# EAGLE design Cellphone (EAGLE 6.1)
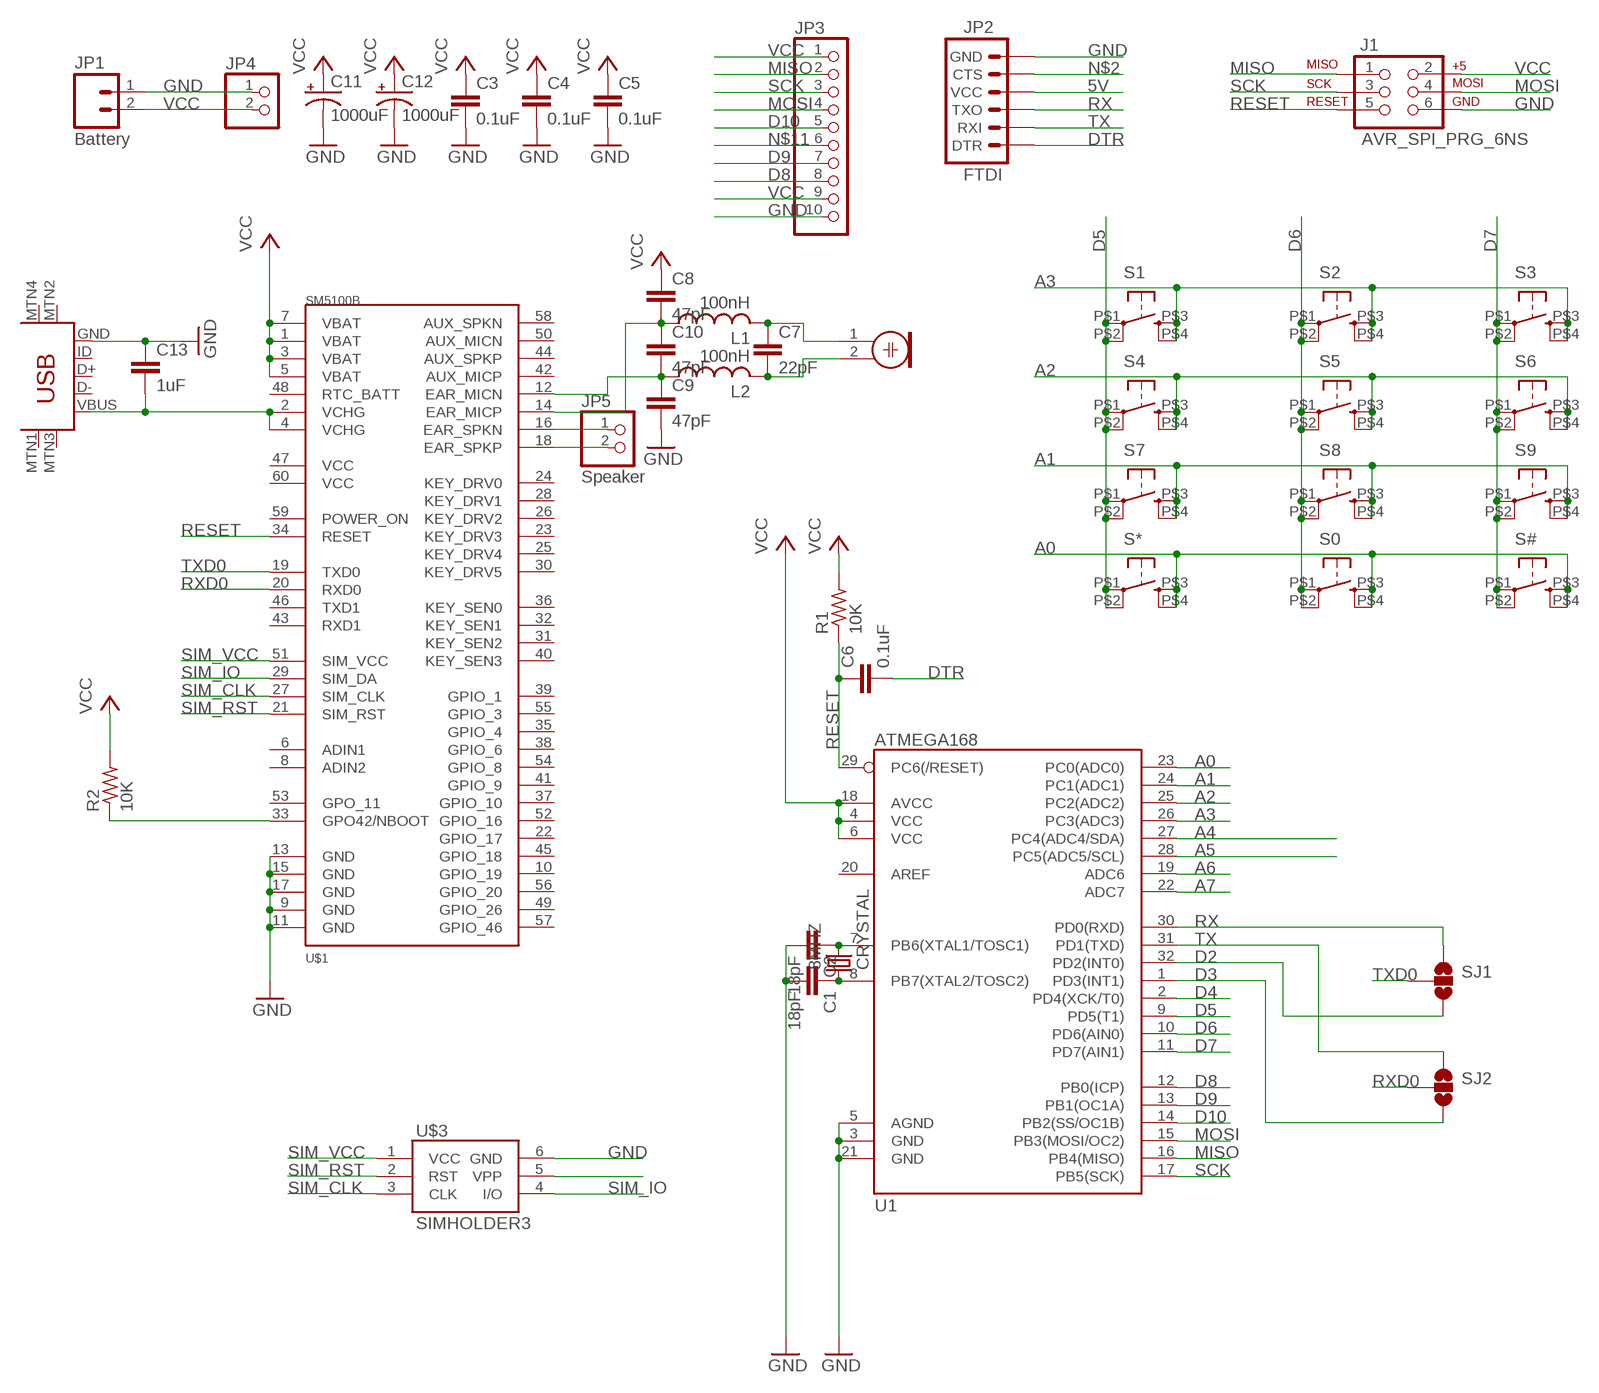
[diagram p0: schematic, sheet 1]

## Parts
8MHZ  CRYSTAL  [2-SMD-5X3MM]
C1  18pF  C-EUC1206  [C1206]
C2  18pF  C-EUC1206  [C1206]
C3  0.1uF  C-EUC1206  [C1206]
C4  0.1uF  C-EUC1206  [C1206]
C5  0.1uF  C-EUC1206  [C1206]
C6  0.1uF  C-EUC1206  [C1206]
C7  22pF  C-EUC1206  [C1206]
C8  47pF  C-EUC1206  [C1206]
C9  47pF  C-EUC1206  [C1206]
C10  47pF  C-EUC1206  [C1206]
C11  1000uF  CPOL-USD/7343-31R  [D/7343-31R]
C12  1000uF  CPOL-USD/7343-31R  [D/7343-31R]
C13  1uF  C-EUC1206  [C1206]
J1  AVR_SPI_PRG_6NS  [2X3-NS]
JP1  Battery  M02-JST-2MM-SMT  [JST-2-SMD]
JP2  FTDI  ARDUINO_SERIAL_PROGRAMPTH  [1X06]
JP3  TFT160X128  [TFT1.8]
JP4  PINHD-1X2  [1X02]
JP5  Speaker  PINHD-1X2  [1X02]
L1  100nH  L-USL2012C  [L2012C]
L2  100nH  L-USL2012C  [L2012C]
M1  ELECTRET_MICROPHON-WM-64PC/64PK  [WM-64PC/64PK]
R1  10K  R-US_R1206  [R1206]
R2  10K  R-US_R1206  [R1206]
S0  SWITCH-JLEAD  [BUTTON_6MM_JLEAD]
S1  SWITCH-JLEAD  [BUTTON_6MM_JLEAD]
S2  SWITCH-JLEAD  [BUTTON_6MM_JLEAD]
S3  SWITCH-JLEAD  [BUTTON_6MM_JLEAD]
S4  SWITCH-JLEAD  [BUTTON_6MM_JLEAD]
S5  SWITCH-JLEAD  [BUTTON_6MM_JLEAD]
S6  SWITCH-JLEAD  [BUTTON_6MM_JLEAD]
S7  SWITCH-JLEAD  [BUTTON_6MM_JLEAD]
S8  SWITCH-JLEAD  [BUTTON_6MM_JLEAD]
S9  SWITCH-JLEAD  [BUTTON_6MM_JLEAD]
S#  SWITCH-JLEAD  [BUTTON_6MM_JLEAD]
S*  SWITCH-JLEAD  [BUTTON_6MM_JLEAD]
SJ1  SOLDERJUMPER_2WAYPASTE1&2  [SJ_3_PASTE1&2]
SJ2  SOLDERJUMPER_2WAYPASTE1&2  [SJ_3_PASTE1&2]
U1  ATMEGA168  [TQFP32-08]
U$1  SM5100B  [SM5100B]
U$2  USB-MINIB-5PIN  [USB-MINIB]
U$3  SIMHOLDER3  [SIMHOLDER3]

## Nets
5V: JP2.4(VCC)
A0: S0.P$3(S) S0.P$4(S1) S#.P$3(S) S#.P$4(S1) S*.P$3(S) S*.P$4(S1) U1.23(PC0(ADC0))
A1: S7.P$3(S) S7.P$4(S1) S8.P$3(S) S8.P$4(S1) S9.P$3(S) S9.P$4(S1) U1.24(PC1(ADC1))
A2: S4.P$3(S) S4.P$4(S1) S5.P$3(S) S5.P$4(S1) S6.P$3(S) S6.P$4(S1) U1.25(PC2(ADC2))
A3: S1.P$3(S) S1.P$4(S1) S2.P$3(S) S2.P$4(S1) S3.P$3(S) S3.P$4(S1) U1.26(PC3(ADC3))
A4: U1.27(PC4(ADC4/SDA))
A5: U1.28(PC5(ADC5/SCL))
A6: U1.19(ADC6)
A7: U1.22(ADC7)
D2: SJ1.3 U1.32(PD2(INT0))
D3: SJ2.3 U1.1(PD3(INT1))
D4: U1.2(PD4(XCK/T0))
D5: S1.P$1(P) S1.P$2(P1) S4.P$1(P) S4.P$2(P1) S7.P$1(P) S7.P$2(P1) S*.P$1(P) S*.P$2(P1) U1.9(PD5(T1))
D6: S0.P$1(P) S0.P$2(P1) S2.P$1(P) S2.P$2(P1) S5.P$1(P) S5.P$2(P1) S8.P$1(P) S8.P$2(P1) U1.10(PD6(AIN0))
D7: S3.P$1(P) S3.P$2(P1) S6.P$1(P) S6.P$2(P1) S9.P$1(P) S9.P$2(P1) S#.P$1(P) S#.P$2(P1) U1.11(PD7(AIN1))
D8: JP3.8(RESET) U1.12(PB0(ICP))
D9: JP3.7(D/C) U1.13(PB1(OC1A))
D10: JP3.5(TFT_CS) U1.14(PB2(SS/OC1B))
DTR: C6.2 JP2.1(DTR)
GND [power]: C1.2 C2.2 C3.2 C4.2 C5.2 C9.2 C11.- C12.- C13.1 J1.6 JP1.1 JP2.6(GND) JP3.10(GND) JP4.1 U1.3(GND) U1.5(AGND) U1.21(GND) U$1.9(GND) U$1.11(GND) U$1.13(GND) U$1.15(GND) U$1.17(GND) U$2.GND U$3.6(GND)
MISO: J1.1 JP3.2(MISO) U1.16(PB4(MISO))
MOSI: J1.4 JP3.4(MOSI) U1.15(PB3(MOSI/OC2))
N$1: R2.1 U$1.33(GPO42/NBOOT)
N$2: JP2.5(CTS)
N$3: 8MHZ.P$2 C2.1 U1.7(PB6(XTAL1/TOSC1))
N$4: 8MHZ.P$1 C1.1 U1.8(PB7(XTAL2/TOSC2))
N$5: C7.1 L1.2 M1.1
N$6: U$3.5(VPP)
N$7: C7.2 L2.2 M1.2
N$8: C8.2 C10.1 L1.1 U$1.14(EAR_MICP)
N$9: C9.1 C10.2 L2.1 U$1.12(EAR_MICN)
N$10 [power]: C13.2 U$1.2(VCHG) U$1.4(VCHG) U$2.VBUS
N$11: JP3.6(CARD_CS)
N$13: JP5.1 U$1.16(EAR_SPKN)
N$14: JP5.2 U$1.18(EAR_SPKP)
RESET: C6.1 J1.5 R1.1 U1.29(PC6(/RESET)) U$1.34(RESET)
RX: JP2.3(TXO) SJ1.1 U1.30(PD0(RXD))
RXD0: SJ2.2 U$1.20(RXD0)
SCK: J1.3 JP3.3(SCK) U1.17(PB5(SCK))
SIM_CLK: U$1.27(SIM_CLK) U$3.3(CLK)
SIM_IO: U$1.29(SIM_DA) U$3.4(I/O)
SIM_RST: U$1.21(SIM_RST) U$3.2(RST)
SIM_VCC: U$1.51(SIM_VCC) U$3.1(VCC)
TX: JP2.2(RXI) SJ2.1 U1.31(PD1(TXD))
TXD0: SJ1.2 U$1.19(TXD0)
VCC [power]: C3.1 C4.1 C5.1 C8.1 C11.+ C12.+ J1.2 JP1.2 JP3.1(LITE) JP3.9(VCC) JP4.2 R1.2 R2.2 U1.4(VCC) U1.6(VCC) U1.18(AVCC) U$1.1(VBAT) U$1.3(VBAT) U$1.5(VBAT) U$1.7(VBAT)
Unconnected: U1.20(AREF) U$1.6(ADIN1) U$1.8(ADIN2) U$1.10(GPIO_19) U$1.22(GPIO_17) U$1.23(KEY_DRV3) U$1.24(KEY_DRV0) U$1.25(KEY_DRV4) U$1.26(KEY_DRV2) U$1.28(KEY_DRV1) U$1.30(KEY_DRV5) U$1.31(KEY_SEN2) U$1.32(KEY_SEN1) U$1.35(GPIO_4) U$1.36(KEY_SEN0) U$1.37(GPIO_10) U$1.38(GPIO_6) U$1.39(GPIO_1) U$1.40(KEY_SEN3) U$1.41(GPIO_9) U$1.42(AUX_MICP) U$1.43(RXD1) U$1.44(AUX_SPKP) U$1.45(GPIO_18) U$1.46(TXD1) U$1.47(VCC) U$1.48(RTC_BATT) U$1.49(GPIO_26) U$1.50(AUX_MICN) U$1.52(GPIO_16) U$1.53(GPO_11) U$1.54(GPIO_8) U$1.55(GPIO_3) U$1.56(GPIO_20) U$1.57(GPIO_46) U$1.58(AUX_SPKN) U$1.59(POWER_ON) U$1.60(VCC) U$2.D+ U$2.D- U$2.ID U$2.MTN1(MTN2) U$2.MTN2(MTN3) U$2.MTN3(MTN1) U$2.MTN4

## Library data of the parts
8MHZ = fab:CRYSTAL
C1-C10 C13 = rcl:C-EU: CAPACITOR, European symbol
C11 C12 = rcl:CPOL-US: POLARIZED CAPACITOR, American symbol
J1 = SparkFun-Connectors:AVR_SPI_PRG_6: AVR ISP 6 Pin This is the reduced ISP connector for AVR programming. Common on Arduino. This footprint will take up less PCB space and can be used with a 10-pin to 6-pin adapter such as SKU: BOB-08508
JP1 = SparkFun-Connectors:M02: Header 2 Standard 2-pin 0.1" header. Use with straight break away headers (SKU : PRT-00116), right angle break away headers (PRT-00553), swiss pins (PRT-00743), machine pins (PRT-00117), and female headers (PRT-00115). Molex polarized connector foot print use with SKU : PRT-08233 with associated crimp pins and housings.
JP2 = SparkFun-Connectors:ARDUINO_SERIAL_PROGRAM: FTDI connector footprints
JP3 = cellphone:TFT160X128: PIN HEADER
JP4 JP5 = pinhead:PINHD-1X2: PIN HEADER
L1 L2 = rcl:L-US: INDUCTOR, American symbol
M1 = microphon:ELECTRET_MICROPHON-: Electret Condenser Microphone
R1 R2 = rcl:R-US_: RESISTOR, American symbol
S0 S1-S9 S# S* = cellphone:SWITCH-JLEAD: Digikey #EG4374CT-ND. SWITCH TACTILE SPST-NO 0.05A 12V. 6.00mm x 6.00mm.
SJ1 SJ2 = SparkFun-Passives:SOLDERJUMPER_2WAY: Solder Jumper 2 way solder jumper
U1 = SparkFun-DigitalIC:ATMEGA168: Atmel 32-pin 8-bit micro, 16k flash.
U$1 = cellphone:SM5100B: Quad-band GSM modem
U$2 = SparkFun-Connectors:USB-MINIB: Mini-USB "B" connector with 5th pin broken out. Created new symbol breaking out 5th "ID" pin in mini/micro USB connector spec. See: http://en.wikipedia.org/wiki/Mini_usb#Cables. Uses same footprint as 4-pin symbol. Also added pins to connect to mounting / shield pads if required (probably not generally needed as signals aren't shielded once they leave the connector).
U$3 = SparkFun-Connectors:SIMHOLDER3: Alternate SIM card socket

## Net classes
1 power: width 0.508 mm

## Board
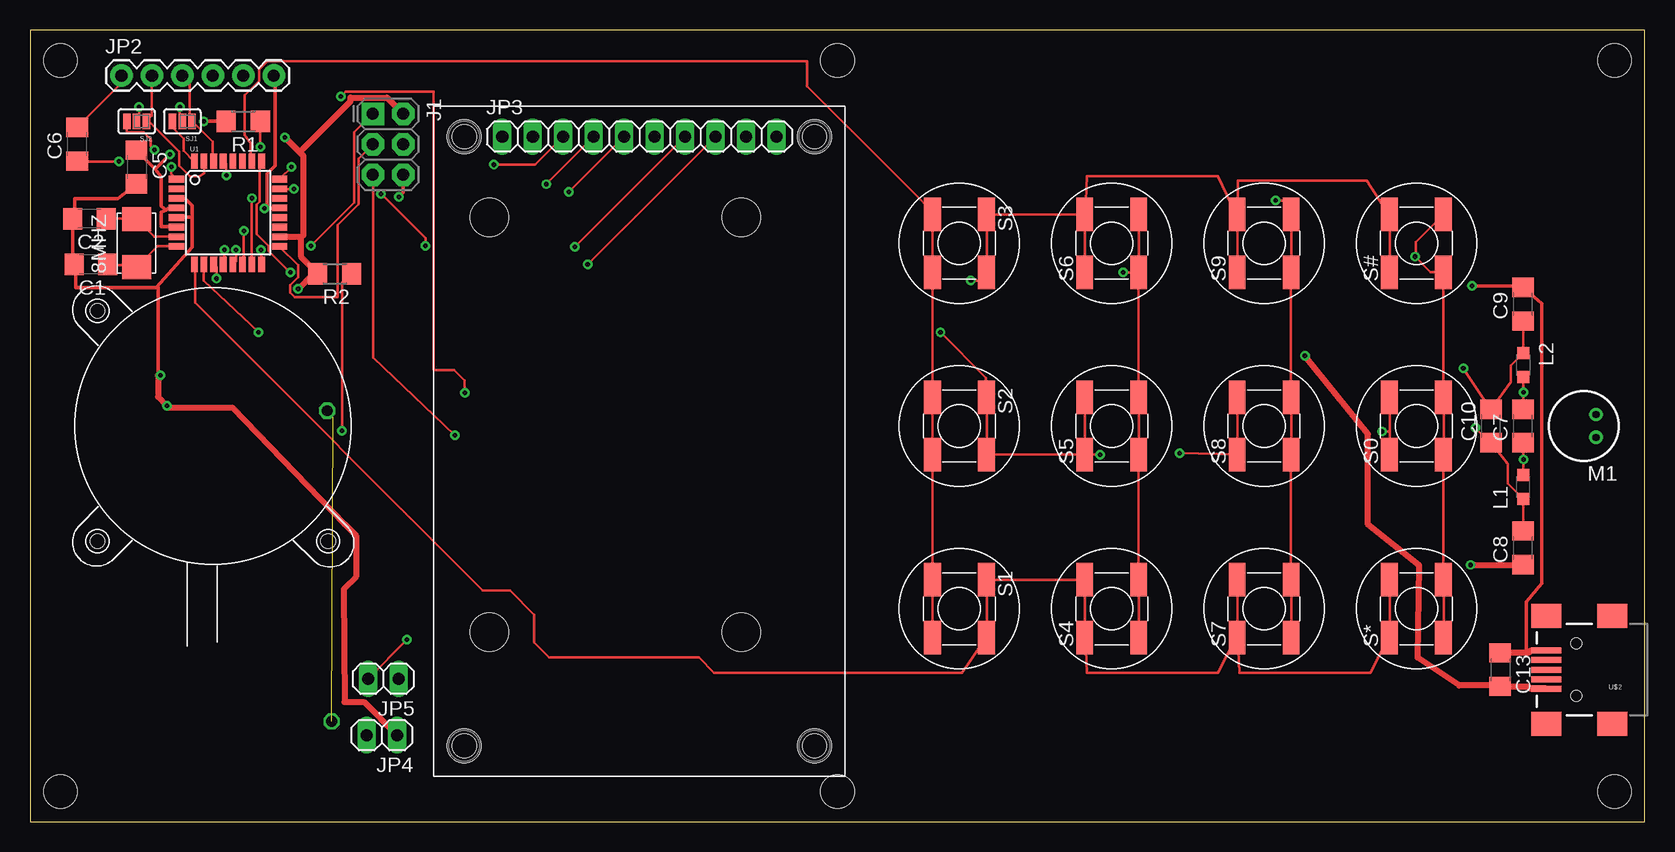
[diagram p1: board, top side]
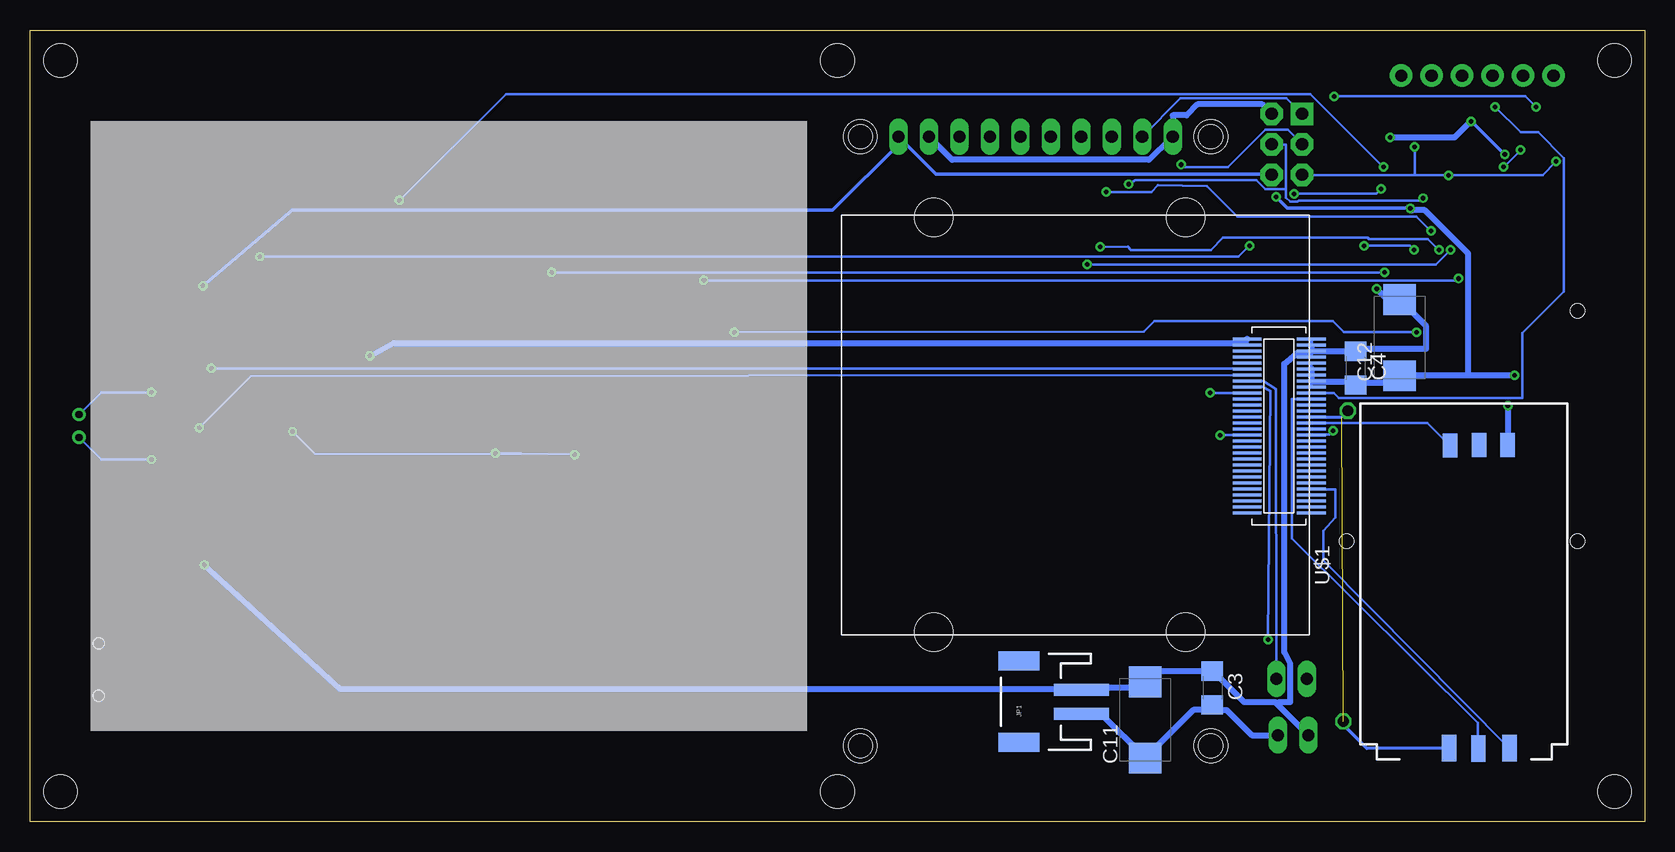
[diagram p2: board, bottom side, seen from below]

Size 134.62 x 66.04 mm. Coordinates in mm from the lower left corner, seen from the top.
Outline: 0,0 134.62,0 134.62,66.04 0,66.04 0,0
Copper layers (1*16): Top 0.035mm / dielectric 1.5mm / Bottom 0.035mm
Design rules: minimum track width 8mil, minimum drill 15mil, track to track 6mil, track to pad 6mil, pad to pad 6mil, via to via 6mil, smd to smd 6mil, copper to edge 40mil, drill to drill 8mil, minimum pad ring 10mil, minimum via ring 8mil, stop-mask expansion 4mil, vias tented up to drill 0mil, thermal gap 10mil
Holes 2.8 mm at 2.54,2.54 2.54,63.5 132.08,2.54 132.08,63.5 65.41,6.35 36.2,6.35 36.2,57.15 65.41,57.15 67.31,63.5 67.31,2.54

### Footprints (pad centres in the part's own frame; a part is rotated, then mirrored left to right if it is on the bottom)
2-SMD-5X3MM = smd 2 x 2.4: P$1 -2,0; P$2 2,0
C1206 = smd 1.6 x 1.8: 1 -1.4,0; 2 1.4,0
D/7343-31R = smd 2.55 x 2.7: + 3.175,0; - -3.175,0
2X3-NS = drill 1.016 pad 1.88 square: 1 -2.54,-1.27 | drill 1.016 pad 1.88 octagon: 2 -2.54,1.27; 3 0,-1.27; 4 0,1.27; 5 2.54,-1.27; 6 2.54,1.27
JST-2-SMD = smd 1 x 4.6: 1 -1,-3.7; 2 1,-3.7 | smd 1.6 x 3.4: NC1 -3.4,1.5; NC2 3.4,1.5
1X06 = drill 1.016 pad 1.88: 1 0,0; 2 2.54,0; 3 5.08,0; 4 7.62,0; 5 10.16,0; 6 12.7,0
TFT1.8 = drill 1.016 long: 1 -11.43,0; 2 -8.89,0; 3 -6.35,0; 4 -3.81,0; 5 -1.27,0; 6 1.27,0; 7 3.81,0; 8 6.35,0; 9 8.89,0; 10 11.43,0 | hole 2: -14.6,-50.8; 14.6,-50.8; 14.6,0; -14.6,0
1X02 = drill 1.016 long: 1 -1.27,0; 2 1.27,0
L2012C = smd 1 x 1: 1 -1,0; 2 1,0
WM-64PC/64PK = drill 0.6 pad 1: 1 -1,0.95; 2 -1,-0.95
R1206 = smd 1.6 x 1.803: 1 -1.422,0; 2 1.422,0
BUTTON_6MM_JLEAD = smd 2.794 x 1.4: P$1 -2.413,2.25; P$2 2.413,2.25; P$3 -2.413,-2.25; P$4 2.413,-2.25
SJ_3_PASTE1&2 = smd 0.635 x 1.27: 1 -0.813,0; 2 0,0; 3 0.813,0
TQFP32-08 = smd 1.27 x 0.559: 1 -4.293,2.8; 2 -4.293,2; 3 -4.293,1.2; 4 -4.293,0.4; 5 -4.293,-0.4; 6 -4.293,-1.2; 7 -4.293,-2; 8 -4.293,-2.8; 17 4.293,-2.8; 18 4.293,-2; 19 4.293,-1.2; 20 4.293,-0.4; 21 4.293,0.4; 22 4.293,1.2; 23 4.293,2; 24 4.293,2.8 | smd 0.559 x 1.27: 9 -2.8,-4.293; 10 -2,-4.293; 11 -1.2,-4.293; 12 -0.4,-4.293; 13 0.4,-4.293; 14 1.2,-4.293; 15 2,-4.293; 16 2.8,-4.293; 25 2.8,4.293; 26 2,4.293; 27 1.2,4.293; 28 0.4,4.293; 29 -0.4,4.293; 30 -1.2,4.293; 31 -2,4.293; 32 -2.8,4.293
SM5100B = smd 0.25 x 2.4: 1 7.25,-2.68; 2 7.25,2.68; 3 6.75,-2.68; 4 6.75,2.68; 5 6.25,-2.68; 6 6.25,2.68; 7 5.75,-2.68; 8 5.75,2.68; 9 5.25,-2.68; 10 5.25,2.68; 11 4.75,-2.68; 12 4.75,2.68; 13 4.25,-2.68; 14 4.25,2.68; 15 3.75,-2.68; 16 3.75,2.68; 17 3.25,-2.68; 18 3.25,2.68; 19 2.75,-2.68; 20 2.75,2.68; 21 2.25,-2.68; 22 2.25,2.68; 23 1.75,-2.68; 24 1.75,2.68; 25 1.25,-2.68; 26 1.25,2.68; 27 0.75,-2.68; 28 0.75,2.68; 29 0.25,-2.68; 30 0.25,2.68; 31 -0.25,-2.68; 32 -0.25,2.68; 33 -0.75,-2.68; 34 -0.75,2.68; 35 -1.25,-2.68; 36 -1.25,2.68; 37 -1.75,-2.68; 38 -1.75,2.68; 39 -2.25,-2.68; 40 -2.25,2.68; 41 -2.75,-2.68; 42 -2.75,2.68; 43 -3.25,-2.68; 44 -3.25,2.68; 45 -3.75,-2.68; 46 -3.75,2.68; 47 -4.25,-2.68; 48 -4.25,2.68; 49 -4.75,-2.68; 50 -4.75,2.68; 51 -5.25,-2.68; 52 -5.25,2.68; 53 -5.75,-2.68; 54 -5.75,2.68; 55 -6.25,-2.68; 56 -6.25,2.68; 57 -6.75,-2.68; 58 -6.75,2.68; 59 -7.25,-2.68; 60 -7.25,2.68 | hole 3.2: -17.2,7.8; 17.4,7.8; -17.2,28.8; 17.4,28.8
USB-MINIB = smd 2.5 x 0.5: D+ 2.5,0; D- 2.5,0.8; GND 2.5,-1.6; ID 2.5,-0.8; VBUS 2.5,1.6 | smd 2.5 x 2: MTN1 -3,4.5; MTN2 2.5,4.5; MTN3 -3,-4.5; MTN4 2.5,-4.5 | hole 0.9: 0,2.2; 0,-2.2
SIMHOLDER3 = smd 2.2 x 1.2: 1 0.95,4.81; 2 0.91,7.41; 3 0.95,9.86 | smd 2 x 1.2: 4 26.2,9.78; 5 26.22,7.34; 6 26.22,4.98
SPEAKER_23MM = hole 1.2: 13.6,0; 0,-13.6; 0,13.6; 0,13.6

### Placement (x,y rotation side)
8MHZ  8.89,48.26 90 top
C1  5.08,46.48 180 top
C2  4.95,50.29 180 top
C3  36.07,11.18 270 bottom
C4  24.13,37.85 270 bottom
C5  8.89,54.61 270 top
C6  3.94,56.52 90 top
C7  124.46,33.02 90 top
C8  124.46,22.86 90 top
C9  124.46,43.18 90 top
C10  121.79,33.02 90 top
C11  41.66,8.51 90 bottom
C12  20.45,40.39 90 bottom
C13  122.56,12.7 270 top
J1  29.84,56.52 270 top
JP1  50.67,10.03 90 bottom
JP2  7.62,62.23 0 top
JP3  50.8,57.15 0 top
JP4  29.34,7.24 180 top
JP5  29.46,11.94 180 top
L1  124.46,27.94 90 top
L2  124.46,38.1 270 top
M1  129.54,33.02 180 top
R1  17.78,58.42 180 top
R2  25.4,45.72 180 top
S0  115.57,33.02 90 top
S1  77.47,17.78 270 top
S2  77.47,33.02 270 top
S3  77.47,48.26 270 top
S4  90.17,17.78 90 top
S5  90.17,33.02 90 top
S6  90.17,48.26 90 top
S7  102.87,17.78 90 top
S8  102.87,33.02 90 top
S9  102.87,48.26 90 top
S#  115.57,48.26 90 top
S*  115.57,17.78 90 top
SJ1  12.7,58.42 180 top
SJ2  8.89,58.42 180 top
U1  16.51,50.8 0 top
U$1  30.48,33.02 90 bottom
U$2  128.91,12.7 180 top
U$3  6.48,5.21 90 bottom
U$5  [SPEAKER_23MM]  15.24,33.02 225 top

### Tracks (layer width: path | path; a pad name or v marks a point on that pad's centre or on a via)
A0  (via drill 0.38)
  Top 0.203: S*.P$3 117.86,15.39 117.86,20.17 S*.P$4 117.81,20.27 117.81,30.53 S0.P$3 117.86,30.63 117.86,35.41 S0.P$4 117.81,35.51 117.81,45.77 S#.P$3 117.81,45.87 116.74,45.87 v115.47,47.14 115.52,47.19 115.52,48.36 117.81,50.65 S#.P$4 | v22,52.78 20.83,52.78 U1.23 | v29.26,52.38 32.97,48.67 v32.97,48.06
  Bottom 0.203: v22,52.78 22.4,52.38 v29.26,52.38 | v32.97,48.06 33.88,47.14 v115.47,47.14
A1  (via drill 0.38)
  Top 0.203: S7.P$3 105.16,15.39 105.16,20.17 S7.P$4 105.11,20.27 105.11,30.53 S8.P$3 105.16,30.63 105.16,35.41 S8.P$4 105.11,35.51 105.11,45.77 S9.P$3 105.16,45.87 105.16,50.6 S9.P$4 105.11,50.7 105.11,51.82 v103.83,51.82 | v21.79,54.61 20.83,53.65 U1.24
  Bottom 0.203: v21.79,54.61 27.89,60.71 94.94,60.71 v103.83,51.82
A2  (via drill 0.38)
  Top 0.203: S4.P$3 92.46,15.39 92.46,20.17 S4.P$4 92.41,20.27 92.41,30.53 S5.P$3 92.46,30.63 92.46,35.41 S5.P$4 92.41,35.51 92.41,45.72 S6.P$3 | v21.69,45.82 19.91,47.6 19.91,48.01 18.9,49.02 18.9,51.46 19.15,51.71 19.15,54.91 19.3,55.07 U1.25 | v91.14,45.82 92.41,45.82 S6.P$3 | S6.P$4 92.46,50.65 92.46,45.92 S6.P$3
  Bottom 0.203: v91.14,45.82 v21.69,45.82
A3
  Top 0.203: S1.P$4 75.23,15.39 75.23,20.17 S1.P$3 75.23,20.27 75.23,30.53 S2.P$4 75.23,30.63 75.23,35.41 S2.P$3 75.23,35.51 75.23,45.77 S3.P$4 75.23,45.87 75.23,50.6 S3.P$3 75.18,50.7 75.18,50.95 64.77,61.37 64.77,63.45 19.81,63.45 19.1,62.74 19.1,61.82 17.88,60.6 17.88,57.28 18.41,56.62 18.41,55.32 18.49,55.12 U1.26
D2
  Top 0.203: SJ1.3 11.89,57.91 12.8,57 12.8,55.98 13.66,55.12 U1.32
D3  (via drill 0.38)
  Top 0.203: v11.79,54.61 11.79,54.05 12.19,53.65 U1.1 | v10.36,56.03 10.06,56.34 10.06,56.95 9.5,57.51 8.08,57.51 SJ2.3
  Bottom 0.203: v10.36,56.03 v11.79,54.61
D5
  Top 0.203: S*.P$2 113.33,20.17 113.33,15.39 S*.P$1 113.23,15.34 111.73,12.45 100.81,12.45 100.69,15.29 S7.P$1 | S7.P$1 100.64,15.39 100.64,20.17 S7.P$2 | U1.9 13.72,46.48 13.77,46.51 13.77,43.31 37.72,19.3 40.01,19.3 42.04,17.27 42.04,14.96 43.28,13.72 55.75,13.72 57.02,12.45 77.67,12.45 79.7,15.34 S1.P$2 79.76,15.44 79.76,20.17 S1.P$1 79.86,20.17 87.83,20.17 S4.P$2 87.94,20.17 87.94,15.39 S4.P$1 87.99,15.29 88.11,12.45 99.03,12.45 100.53,15.34 S7.P$1
D6  (via drill 0.38)
  Top 0.203: 113.33,32.56 113.33,35.41 S0.P$2 | 113.33,32.56 113.33,30.63 S0.P$1 | S8.P$2 100.64,35.41 100.64,30.63 S8.P$1 100.53,30.63 v95.83,30.76 | S5.P$1 87.94,30.63 87.94,35.41 S5.P$2 | v19.05,40.84 14.48,45.16 14.48,46.28 14.53,46.48 U1.10 | v75.89,40.84 79.7,37.03 79.7,35.46 S2.P$1 79.76,35.36 79.76,30.63 S2.P$2 79.86,30.63 87.83,30.63 S5.P$1 | v89.2,30.63 88.04,30.63 S5.P$1 | v112.72,32.56 113.33,32.56
  Bottom 0.203: v75.89,40.84 41.78,40.89 40.89,41.78 26.04,41.78 25.09,40.84 v19.05,40.84 | v89.2,30.63 v95.83,30.76 93.73,30.68 110.85,30.68 v112.72,32.56
D7  (via drill 0.38)
  Top 0.203: S#.P$1 113.33,45.87 113.33,50.65 S#.P$2 113.23,50.7 111.45,53.49 100.69,53.49 100.69,50.75 S9.P$2 | S9.P$1 100.64,45.87 100.64,50.65 S9.P$2 | S6.P$1 87.94,45.87 87.94,50.65 S6.P$2 | v15.54,45.31 15.54,46.28 15.34,46.48 U1.11 | v78.44,45.16 79.7,45.16 79.7,45.82 S3.P$2 79.76,45.92 79.76,50.65 S3.P$1 79.86,50.65 87.83,50.65 S6.P$2 | S9.P$2 100.53,50.7 99.03,53.85 88.11,53.85 87.99,50.75 S6.P$2
  Bottom 0.203: v15.54,45.31 15.7,45.16 v78.44,45.16
D8  (via drill 0.38)
  Top 0.203: v16.2,47.7 16.2,46.58 16.15,46.53 U1.12 | JP3.8 v46.48,46.48
  Bottom 0.203: v16.2,47.7 17.42,46.48 v46.48,46.48
D9  (via drill 0.38)
  Top 0.203: v17.17,47.7 17.17,46.79 16.92,46.53 U1.13 | JP3.7 v45.41,47.95
  Bottom 0.203: v17.17,47.7 18.09,48.62 23.01,48.62 23.11,48.72 35.18,48.72 36.2,47.7 42.85,47.7 43.1,47.98 v45.41,47.95
D10  (via drill 0.38)
  Top 0.203: v17.83,49.28 17.83,46.63 17.73,46.53 U1.14 | JP3.5 v44.91,52.53
  Bottom 0.203: v17.83,49.28 19.05,50.49 33.96,50.49 36.5,53.03 40.59,53.09 41.15,52.53 v44.91,52.53
DTR
  Top 0.203: JP2.1 7.62,61.62 3.96,57.96 C6.2
GND  (via drill 0.38)
  Top 0.305: 20.78,51.21 19.76,51.21 19.76,54.05 20.42,54.71 20.42,62.13 JP2.6 | 13.51,50.44 12.24,50.44 | 13.51,50.44 13.51,51.41 12.95,51.97 12.24,51.97 | C2.2 3.56,46.58 | 8.89,53.19 7.32,51.99 3.71,51.99 3.71,50.49 | 13.51,50.44 13.51,47.93 10.52,44.55 | 10.52,44.55 3.81,44.55 3.81,46.28 | 10.67,37.24 10.67,44.6 10.52,44.55 | 124.46,44.55 126.03,43.23 126.03,19.91 124.71,18.34 124.71,14.12 | v120.22,44.7 124.26,44.7 | v30.73,52.12 31.09,52.48 31.09,53.95 J1.6
  Top 0.508: 20.78,51.21 U1.21 | 12.24,50.44 U1.5 | 12.24,51.97 U1.3 | 3.56,46.58 3.66,46.48 C1.2 3.81,46.28 | C2.2 3.71,50.49 | 8.89,53.19 C5.2 | v10.87,37.24 10.67,37.24 10.67,35.46 v11.43,34.7 11.63,34.54 16.89,34.54 26.21,24.84 27.18,23.88 27.18,20.45 26.16,19.43 26.16,19.3 26.21,10.01 27.84,10.01 JP4.1 | v19.56,51.16 19.76,51.21 | C13.1 122.58,14.12 124.71,14.12 124.92,14.12 125.07,14.28 126.39,14.28 U$2.GND | 124.46,44.55 C9.2 124.26,44.7
  Bottom 0.254: U$1.11 U$1.9 | U$1.17 U$1.15
  Bottom 0.305: J1.6 31.14,54 59.08,54 JP3.10 62.08,56.64 67.72,51 112.78,51 v120.22,44.7 | 19.76,51.21 29.82,51.21 v30.73,52.12
  Bottom 0.508: JP4.1 32.77,7.24 34.87,9.35 36.12,9.35 | 36.12,9.35 C3.2 | U$1.11 27.79,37.74 27.79,37.54 U$1.13 27.79,37.24 27.79,37.03 U$1.15 27.79,36.73 24.38,36.73 24.13,36.47 C4.2 23.93,36.63 21.03,36.63 C12.- 20.22,37.24 14.73,37.24 | v11.43,34.7 11.43,31.45 U$3.6 | v10.87,37.24 14.73,37.24 | 14.73,37.24 14.73,47.4 18.34,51 19.41,51 v19.56,51.16 19.76,51.21 | 36.12,9.35 37.64,9.35 C11.- 45.35,9.03 JP1.1
MISO  (via drill 0.38)
  Top 0.203: v19.25,47.7 19.25,46.58 19.3,46.53 U1.16 | v23.42,48.06 27.03,51.66 27.03,57.51 J1.1
  Bottom 0.203: v19.25,47.7 19.61,48.06 v23.42,48.06 | JP3.2 38.71,60.35 29.87,60.35 J1.1
MOSI  (via drill 0.38)
  Top 0.203: v18.49,52.02 18.49,46.53 U1.15 | v43.03,53.19 JP3.4
  Bottom 0.203: v18.49,52.02 18.69,51.82 28.85,51.82 28.96,51.71 29.57,51.71 29.92,52.07 29.92,52.78 | 29.92,52.78 29.92,56.49 31.09,56.49 J1.4 | v43.03,53.19 42.47,53.52 32.38,53.52 31.65,52.78 29.92,52.78
N$1  (via drill 0.38)
  Top 0.203: v26.01,32.61 26.01,44.96 26.77,45.72 R2.1
  Bottom 0.203: v26.01,32.61 26.31,32.31 27.79,32.31 U$1.33
N$3
  Top 0.203: C2.1 8.84,50.29 8MHZ.P$2 10.35,48.8 U1.7
N$4
  Top 0.203: 6.5,46.48 C1.1 6.55,46.43 8.84,46.43 8.84,46.33 8MHZ.P$1 10.63,48 U1.8
N$5  (via drill 0.38)
  Top 0.203: C7.1 124.46,30.23 | 124.46,30.23 L1.2 | v124.51,30.23 124.46,30.23
  Bottom 0.203: v124.51,30.23 128.68,30.23 130.5,32.05 M1.1
N$7  (via drill 0.38)
  Top 0.203: C7.2 124.46,35.81 | 124.46,35.81 L2.2 | v124.51,35.81 124.46,35.81
  Bottom 0.203: v124.51,35.81 128.68,35.81 130.5,33.98 M1.2
N$8  (via drill 0.38)
  Top 0.203: C8.2 L1.1 124.41,27.03 123.19,28.25 123.19,29.84 121.82,31.6 C10.1 121.72,31.65 v120.5,32.87
  Bottom 0.203: v120.5,32.87 116.18,37.19 33.22,37.26 33.17,37.24 U$1.14
N$9  (via drill 0.38)
  Top 0.203: C9.1 L2.1 124.41,39.01 123.44,38.05 123.44,36.7 121.82,34.44 C10.2 121.72,34.44 v119.48,37.82
  Bottom 0.203: v119.48,37.82 33.2,37.8 33.17,37.74 U$1.12
N$10  (via drill 0.38)
  Top 0.508: U$2.VBUS 126.39,11.12 125.07,11.12 124.92,11.28 122.58,11.28 C13.2 122.33,11.38 119.13,11.38 115.67,13.69 115.8,21.41 111.53,24.79 111.53,32.33 v106.27,38.86
  Bottom 0.254: 33.58,39.95 33.16,39.95 U$1.4
  Bottom 0.508: v106.27,38.86 104.29,39.95 33.58,39.95 33.43,39.98 U$1.2
N$13
  Bottom 0.203: JP5.1 30.76,36.09 31.83,36.75 33.05,36.75 33.12,36.73 U$1.16
N$14  (via drill 0.38)
  Top 0.203: JP5.2 v31.42,15.21
  Bottom 0.203: v31.42,15.21 31.24,35.92 31.93,36.3 33.15,36.3 33.12,36.22 U$1.18
RESET  (via drill 0.38)
  Top 0.203: v16.36,53.9 16.36,54.86 16.15,55.07 U1.29 | v7.42,55.07 3.96,55.07 C6.1 | v19.2,56.29 R1.1 | R1.1 | v35.41,32.26 28.6,38.71 28.6,53.95 J1.5
  Bottom 0.203: 19.2,53.95 28.55,53.95 J1.5 | 19.2,53.95 16.41,53.95 v16.36,53.9 16.31,53.95 8.53,53.95 v7.42,55.07 | 19.2,53.95 v19.2,56.29 | v35.41,32.26 33.17,32.26 U$1.34
RX
  Top 0.203: U1.30 15.29,55.12 15.21,55.19 15.21,56.72 SJ1.1 13.31,58.62 13.31,61.62 JP2.3
RXD0  (via drill 0.38)
  Top 0.203: SJ2.2 9.09,58.62 v9.09,59.64 | v25.91,60.5 26.31,60.91 33.63,60.91 33.63,37.69 35.36,37.69 36.22,36.83 v36.25,35.79
  Bottom 0.203: v9.09,59.64 9.96,60.5 v25.91,60.5 | v36.25,35.79 33.17,35.79 U$1.20
SCK  (via drill 0.38)
  Top 0.203: J1.3 27.38,55.32 27.38,51.51 25.65,49.78 25.65,43.79 22.05,43.79 21.69,44.15 21.69,44.76 22.35,45.41 22.35,46.43 20.83,47.95 U1.17 | JP3.3 42.11,54.81 v38.66,54.81
  Bottom 0.203: v38.66,54.81 38.46,54.61 34.75,54.61 31.65,57.71 29.77,57.71 J1.3
SIM_CLK  (via drill 0.9)  (1 unrouted)
  Bottom 0.254: U$3.3 23.18,6.16 | U$1.27 25.29,33.77 v24.77,34.29
  Bottom 0.305: 23.18,6.16 25.15,8.12 v25.15,8.38
SIM_IO
  Bottom 0.203: U$3.4 16.31,31.45 18.14,33.27 27.79,33.27 U$1.29
SIM_RST
  Bottom 0.203: U$3.2 13.92,6.15 13.92,8.28 29.44,23.65 29.44,35.28 27.84,35.26 U$1.21
SIM_VCC
  Bottom 0.203: U$3.1 11.33,6.2 26.82,21.82 26.8,24.26 25.81,25.38 25.81,27.74 27.79,27.74 U$1.51
TX
  Top 0.203: JP2.2 10.16,58.88 SJ2.1 9.86,58.47 12.45,55.88 12.45,54.71 13.36,53.82 14.15,53.85 14.53,54.1 14.48,55.07 U1.31
TXD0  (via drill 0.38)
  Top 0.203: SJ1.2 12.5,58.62 v12.5,59.64
  Bottom 0.203: v12.5,59.64 10.36,57.51 8.89,57.51 6.76,55.37 6.76,44.22 10.21,40.77 10.21,35.36 25.53,35.36 25.93,35.76 27.79,35.76 U$1.19
VCC  (via drill 0.38)
  Top 0.305: 11.35,51.03 11.48,51.16 12.19,51.16 U1.4 | 11.35,51.03 10.92,50.85 10.92,49.63 12.19,49.63 U1.6 | 10.44,54.43 10.92,53.82 10.92,51.33 11.35,51.03 | 10.44,54.43 8.89,55.98 | v14.48,58.42 R1.2 | 10.44,54.43 v11.68,55.68
  Top 0.508: 8.89,55.98 C5.1 | 22.61,48.77 20.83,48.77 U1.18 | 22.61,48.77 22.61,47.09 R2.2 | R2.2 | v22.35,44.45 23.62,45.72 R2.2 | 22.48,55.85 22.81,55.52 22.81,48.92 22.61,48.77 | 22.48,55.85 v21.23,57.1 | J1.2 29.77,60.4 26.72,60.4 26.72,60.1 22.48,55.85 | v120.09,21.44 124.46,21.44 C8.1
  Bottom 0.254: U$1.1 U$1.3 27.8,39.73 27.79,39.73 | U$1.5 U$1.7 28.04,38.77 27.91,39.06
  Bottom 0.305: 11.73,55.68 v14.48,58.42
  Bottom 0.508: J1.2 31.9,59.84 37.29,59.84 38.2,58.93 39.37,58.93 JP3.1 39.57,57 41.35,55.22 57.76,55.22 JP3.9 | v11.68,55.68 11.73,55.68 | 27.79,39.73 27.79,39.52 U$1.5 27.79,39.27 24.13,39.27 C4.1 23.98,39.47 18.24,39.47 18.24,41.35 C12.+ 20.68,43.69 21.59,43.69 v22.35,44.45 | v21.23,57.1 15.85,57.1 14.68,58.27 v14.48,58.42 | 30.66,9.83 30.84,10.01 33.43,10.01 35.87,12.45 C3.1 40.76,12.58 C11.+ 42.42,11.68 42.88,11.23 46.79,11.23 JP1.2 46.99,11.07 108.71,11.07 v120.09,21.44 | 30.66,9.83 JP4.2 | 27.91,39.06 29.03,39.06 30.07,38.2 30.07,14.17 29.57,13.21 29.57,10.01 30.48,10.01 30.66,9.83